# Altium schematic sheet Power_board.SchDoc
size A4
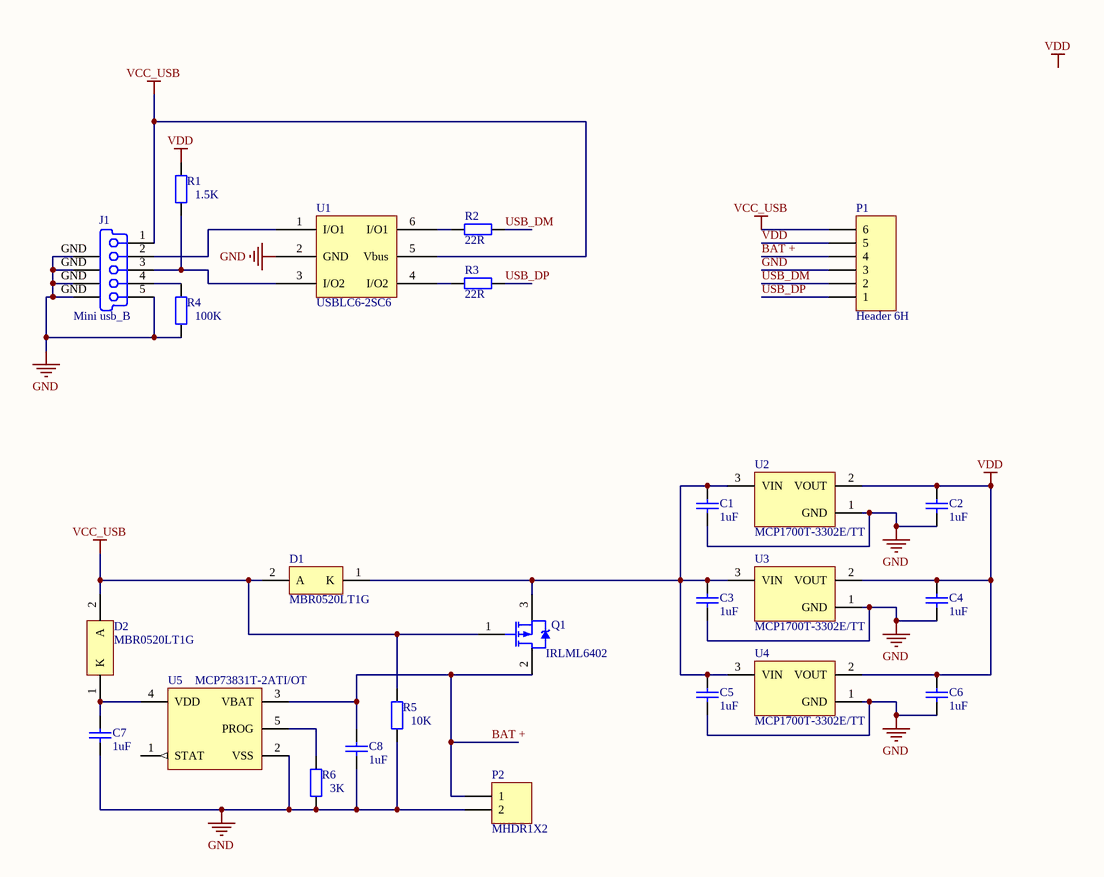
[diagram p0: Power_board.SchDoc]

## Parts
C1  1uF  [C0805]
C2  1uF  [C0805]
C3  1uF  [C0805]
C4  1uF  [C0805]
C5  1uF  [C0805]
C6  1uF  [C0805]
C7  1uF  [C0805]
C8  1uF  [C0805]
D1  MBR0520LT1G  [ONSC-SOD-123-2-425-04_V]
D2  MBR0520LT1G  [ONSC-SOD-123-2-425-04_V]
J1  Mini usb_B  [Mini_USB_B]
P1  Header 6H  [HDR1X6H]
P2  MHDR1X2  [MHDR1X2]
Q1  IRLML6402  [SOT95P237X112-3N]
R1  1.5K  [6-0805_N]
R2  22R  [6-0805_N]
R3  22R  [6-0805_N]
R4  100K  [6-0805_N]
R5  10K  [6-0805_N]
R6  3K  [6-0805_N]
U1  USBLC6-2SC6  [USBLC6-2SC6]
U2  MCP1700T-3302E/TT  [SOT-23-TT3_N]
U3  MCP1700T-3302E/TT  [SOT-23-TT3_N]
U4  MCP1700T-3302E/TT  [SOT-23-TT3_N]
U5  MCP73831T-2ATI/OT  [SOT-23-OT5_N]

## Nets
GND: C1.1 C2.1 C3.1 C4.1 C5.1 C6.1 C7.1 C8.1 J1.5(GND) J1.GND(Tab) P1.3 P2.2 R4.1 R5.1 R6.1 U1.2(GND) U2.1(GND) U3.1(GND) U4.1(GND) U5.2(VSS)
VCC_USB: D1.2(A) D2.2(A) J1.1(V_BUS_(5V)) P1.6 Q1.1(G) R5.2 U1.5(Vbus)
VDD: C2.2 C4.2 C6.2 P1.5 R1.2 U2.2(VOUT) U3.2(VOUT) U4.2(VOUT)
BAT +: C8.2 P1.4 P2.1 Q1.2(D) U5.3(VBAT)
USB_DM: P1.2 R2.2
USB_DP: P1.1 R3.2
NetC1_2: C1.2 C3.2 C5.2 D1.1(K) Q1.3(S) U2.3(VIN) U3.3(VIN) U4.3(VIN)
NetC7_2: C7.2 D2.1(K) U5.4(VDD)
NetJ1_2: J1.2(D-) U1.1(I/O1)
NetJ1_3: J1.3(D+) R1.1 U1.3(I/O2)
NetJ1_4: J1.4(NC) R4.2
NetR2_1: R2.1 U1.6(I/O1)
NetR3_1: R3.1 U1.4(I/O2)
NetR6_2: R6.2 U5.5(PROG)

Not connected (* = marked no-connect by the designer): U5 1(STAT)

## Notes on the sheet
- Labels drawn without touching a wire or pin: VDD

## Library data of the parts
C1-C8 = Cap: Capacitor; Published: 8-Jun-2000; LatestRevisionDate: 17-Jul-2002; LatestRevisionNote: Re-released for DXP Platform.; PackageReference: RAD-0.3; Publisher: Altium Limited; PackageDescription: Radial Cap, Thru-Hole; 2 Leads; 0.3 in Pin Spacing; Value: 1uF
D1 D2 = MBR0520LT1G: Schottky Power Rectifier, 2-Pin SOD-123, Pb-Free, Tape and Reel; Manufacturer: On Semiconductor; Configuration: Single; IFSM Max (A): 5.5; DatasheetVersion: Rev. 6; PackageVersion: Rev. G, 10/2009; PackageReference: SOD-123-2-425-04; PackageDescription: 2-Pin SOD, Body 1.6 x 2.69 mm; Supplier 1: Farnell; Supplier Part Number 1: 9556915; Supplier 2: Farnell; Supplier Part Number 2: 9556915RL; Supplier 3: Farnell; Supplier Part Number 3: 2317669; Supplier 4: Farnell; Supplier Part Number 4: 1562304; Supplier 5: Newark; Supplier Part Number 5: 48K7498; Supplier 6: Newark; Supplier Part Number 6: 83H7278; Supplier 7: Newark; Supplier Part Number 7: 28X7856; Supplier 8: Mouser; Supplier Part Number 8: 863-MBR0520LT1G; Packing: Tape and Reel; RoHS: TRUE; Mounting Technology: Surface Mount; PartNumber: MBR0520LT1G; ComponentLink1Description: Manufacturer URL; ComponentLink1URL: http://www.onsemi.com/; ComponentLink2Description: Datasheet; ComponentLink2URL: http://www.onsemi.cn/pub_link/Collateral/MBR0520LT1-D.PDF; ComponentLink3Description: Package Specification; ComponentLink3URL: http://www.onsemi.com/pub_link/Collateral/425-04.PDF
J1 = Mini usb_B: PCB_Layout: Complies with Manufacturer's Recommendation.; Published: 21-Sep-2007; DatasheetVersion: revA, May-2004; PackageVersion: May-2004; PackageReference: 481900001; Publisher: Altium Limited; PackageDescription: USB Mini-B, Sinking Type, SM; 5 Position; Right Angle, Body 11.45 x 11.8 x 3.9 mm (LxWxH); ComponentLink1Description: Manufacturer Link; ComponentLink1URL: http://www.molex.com/; ComponentLink2Description: Datasheet; ComponentLink2URL: http://www.molex.com/cmc_upload/0/000/895/958/SD-48190-001RevA.pdf
P1 = Header 6H: Header, 6-Pin, Right Angle; LatestRevisionDate: 17-Jul-2002; LatestRevisionNote: Re-released for DXP Platform.; Publisher: Altium Limited
P2 = MHDR1X2: Header, 2-Pin; LatestRevisionDate: 17-Jul-2002; LatestRevisionNote: Re-released for DXP Platform.; Publisher: Altium Limited
R1-R6 = Res2: Resistor; Published: 8-Jun-2000; LatestRevisionDate: 17-Jul-2002; LatestRevisionNote: Re-released for DXP Platform.; PackageReference: AXIAL-0.4; Publisher: Altium Limited; PackageDescription: Axial Device, Thru-Hole; 2 Leads; 0.4 in Pin Spacing
  R1: Value: 1.5K
  R2 R3: Value: 22R
  R4: Value: 100K
  R5: Value: 10K
  R6: Value: 3K
U2-U4 = MCP1700T-3302E/TT: Low Quiescent Current LDO, 3-Pin SOT-23, Extended Temperature, Tape and Reel; Manufacturer: Microchip; DatasheetVersion: revB, Feb-2007; PackageVersion: revBB, Aug-2009; PackageReference: SOT-23-TT3; PackageDescription: 3-Lead Plastic Small Outline Transistor (TT) [SOT-23]; Supplier 1: Digi-Key; Supplier Part Number 1: MCP1700T3302ETTTR-ND; Supplier 2: Digi-Key; Supplier Part Number 2: MCP1700T3302ETTCT-ND; Supplier 3: Digi-Key; Supplier Part Number 3: MCP1700T3302ETTDKR-ND; Supplier 4: Farnell; Supplier Part Number 4: 1296592; Supplier 5: Farnell; Supplier Part Number 5: 1296592RL; Supplier 6: Farnell; Supplier Part Number 6: 2133944; Supplier 7: Newark; Supplier Part Number 7: 88H9817; Supplier 8: Newark; Supplier Part Number 8: 23R8107; Supplier 9: Mouser; Supplier Part Number 9: 579-MCP1700T3302E/TT; Mounting Technology: Surface Mount; Code_IPC: SOT23-3; PartNumber: MCP1700T-3302E/TT; ComponentLink1Description: Manufacturer URL; ComponentLink1URL: http://www.microchip.com/; ComponentLink2Description: Datasheet; ComponentLink2URL: http://ww1.microchip.com/downloads/en/DeviceDoc/21826b.pdf; ComponentLink3Description: Package Specification; ComponentLink3URL: http://www.microchip.com/stellent/groups/techpub_sg/documents/packagingspec/en012702.pdf
U5 = MCP73831T-2ATI/OT: Miniature Single-Cell, Fully Integrated Li-Ion, Li-Polymer Charge Management Controller, 4.2V, 5-Pin SOT-23, Industrial Temperature, Tape and Reel; Manufacturer: Microchip; DatasheetVersion: revE, Sep-2008; PackageVersion: revBB, Aug-2009; PackageReference: SOT-23-OT5; PackageDescription: 5-Lead Plastic Small Outline Transistor (OT) [SOT-23]; Supplier 1: Digi-Key; Supplier Part Number 1: MCP73831T-2ATI/OTTR-ND; Supplier 2: Digi-Key; Supplier Part Number 2: MCP73831T-2ATI/OTCT-ND; Supplier 3: Digi-Key; Supplier Part Number 3: MCP73831T-2ATI/OTDKR-ND; Supplier 4: Farnell; Supplier Part Number 4: 1834890RL; Supplier 5: Farnell; Supplier Part Number 5: 1834890; Supplier 6: Newark; Supplier Part Number 6: 84R5196; Supplier 7: Mouser; Supplier Part Number 7: 579-MCP73831T-2ATIOT; Mounting Technology: Surface Mount; Code_IPC: SOT23-5; PartNumber: MCP73831T-2ATI/OT; ComponentLink1Description: Manufacturer URL; ComponentLink1URL: http://www.microchip.com/; ComponentLink2Description: Datasheet; ComponentLink2URL: http://ww1.microchip.com/downloads/en/DeviceDoc/21984e.pdf; ComponentLink3Description: Package Specification; ComponentLink3URL: http://www.microchip.com/stellent/groups/techpub_sg/documents/packagingspec/en012702.pdf